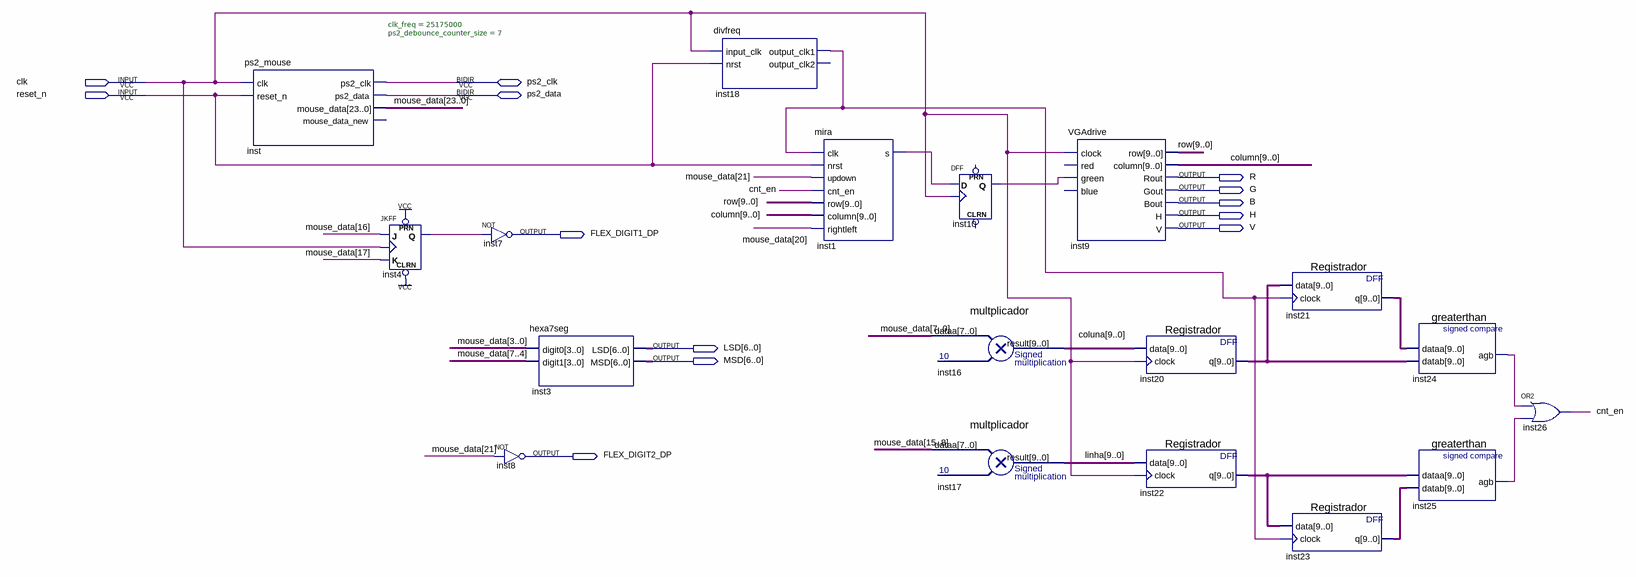
[diagram p0: schematic sheet]
// Quartus schematic mouse.bdf as structural Verilog: 18 symbols, 13 pins
module mouse (
  input  clk,
  input  reset_n,
  inout  ps2_clk,
  inout  ps2_data,
  output R,
  output G,
  output B,
  output H,
  output V,
  output FLEX_DIGIT1_DP,
  output [6:0] LSD,
  output [6:0] MSD,
  output FLEX_DIGIT2_DP
);

  wire cnt_en, inst1_s, inst4_q, inst10_q, inst18_output_clk1, inst24_agb, inst25_agb;
  wire [9:0] column, coluna, inst20_q, inst21_q, inst22_q, inst23_q, linha, row;
  wire [23:0] mouse_data;

  ps2_mouse #(.clk_freq(25175000), .ps2_debounce_counter_size(7)) inst (
    .clk(clk), .reset_n(reset_n), .mouse_data(mouse_data), .ps2_clk(ps2_clk), .ps2_data(ps2_data));  // open: mouse_data_new
  JKFF inst4 (.PRN(1'b1), .CLRN(1'b1), .K(mouse_data[17]), .J(mouse_data[16]), .CLK(clk), .Q(inst4_q));
  not inst7 (FLEX_DIGIT1_DP, inst4_q);
  not inst8 (FLEX_DIGIT2_DP, mouse_data[21]);
  hexa7seg inst3 (.digit0(mouse_data[3:0]), .digit1(mouse_data[7:4]), .LSD(LSD), .MSD(MSD));
  divfreq inst18 (.input_clk(clk), .nrst(reset_n), .output_clk1(inst18_output_clk1));  // open: output_clk2
  mira inst1 (
    .clk(inst18_output_clk1), .nrst(reset_n), .updown(mouse_data[21]), .cnt_en(cnt_en), .row(row),
    .column(column), .rightleft(mouse_data[20]), .s(inst1_s));
  DFF inst10 (.CLK(clk), .D(inst1_s), .Q(inst10_q));  // open: CLRN, PRN
  multplicador inst16 (.dataa(mouse_data[7:0]), .result(coluna));
  multplicador inst17 (.dataa(mouse_data[15:8]), .result(linha));
  VGAdrive inst9 (
    .clock(clk), .green(inst10_q), .row(row), .column(column), .Rout(R), .Gout(G), .Bout(B), .H(H), .V(V));  // open: red, blue
  Registrador inst20 (.data(coluna), .clock(clk), .q(inst20_q));
  Registrador inst22 (.data(linha), .clock(clk), .q(inst22_q));
  Registrador inst21 (.data(inst20_q), .clock(inst18_output_clk1), .q(inst21_q));
  Registrador inst23 (.data(inst22_q), .clock(inst18_output_clk1), .q(inst23_q));
  greaterthan inst24 (.dataa(inst21_q), .datab(inst20_q), .agb(inst24_agb));
  greaterthan inst25 (.dataa(inst22_q), .datab(inst23_q), .agb(inst25_agb));
  or inst26 (cnt_en, inst24_agb, inst25_agb);
endmodule
